# Altium schematic sheet GPT_NLP_DC Board.SchDoc
size C; SheetNumber: 1; SheetTotal: 4
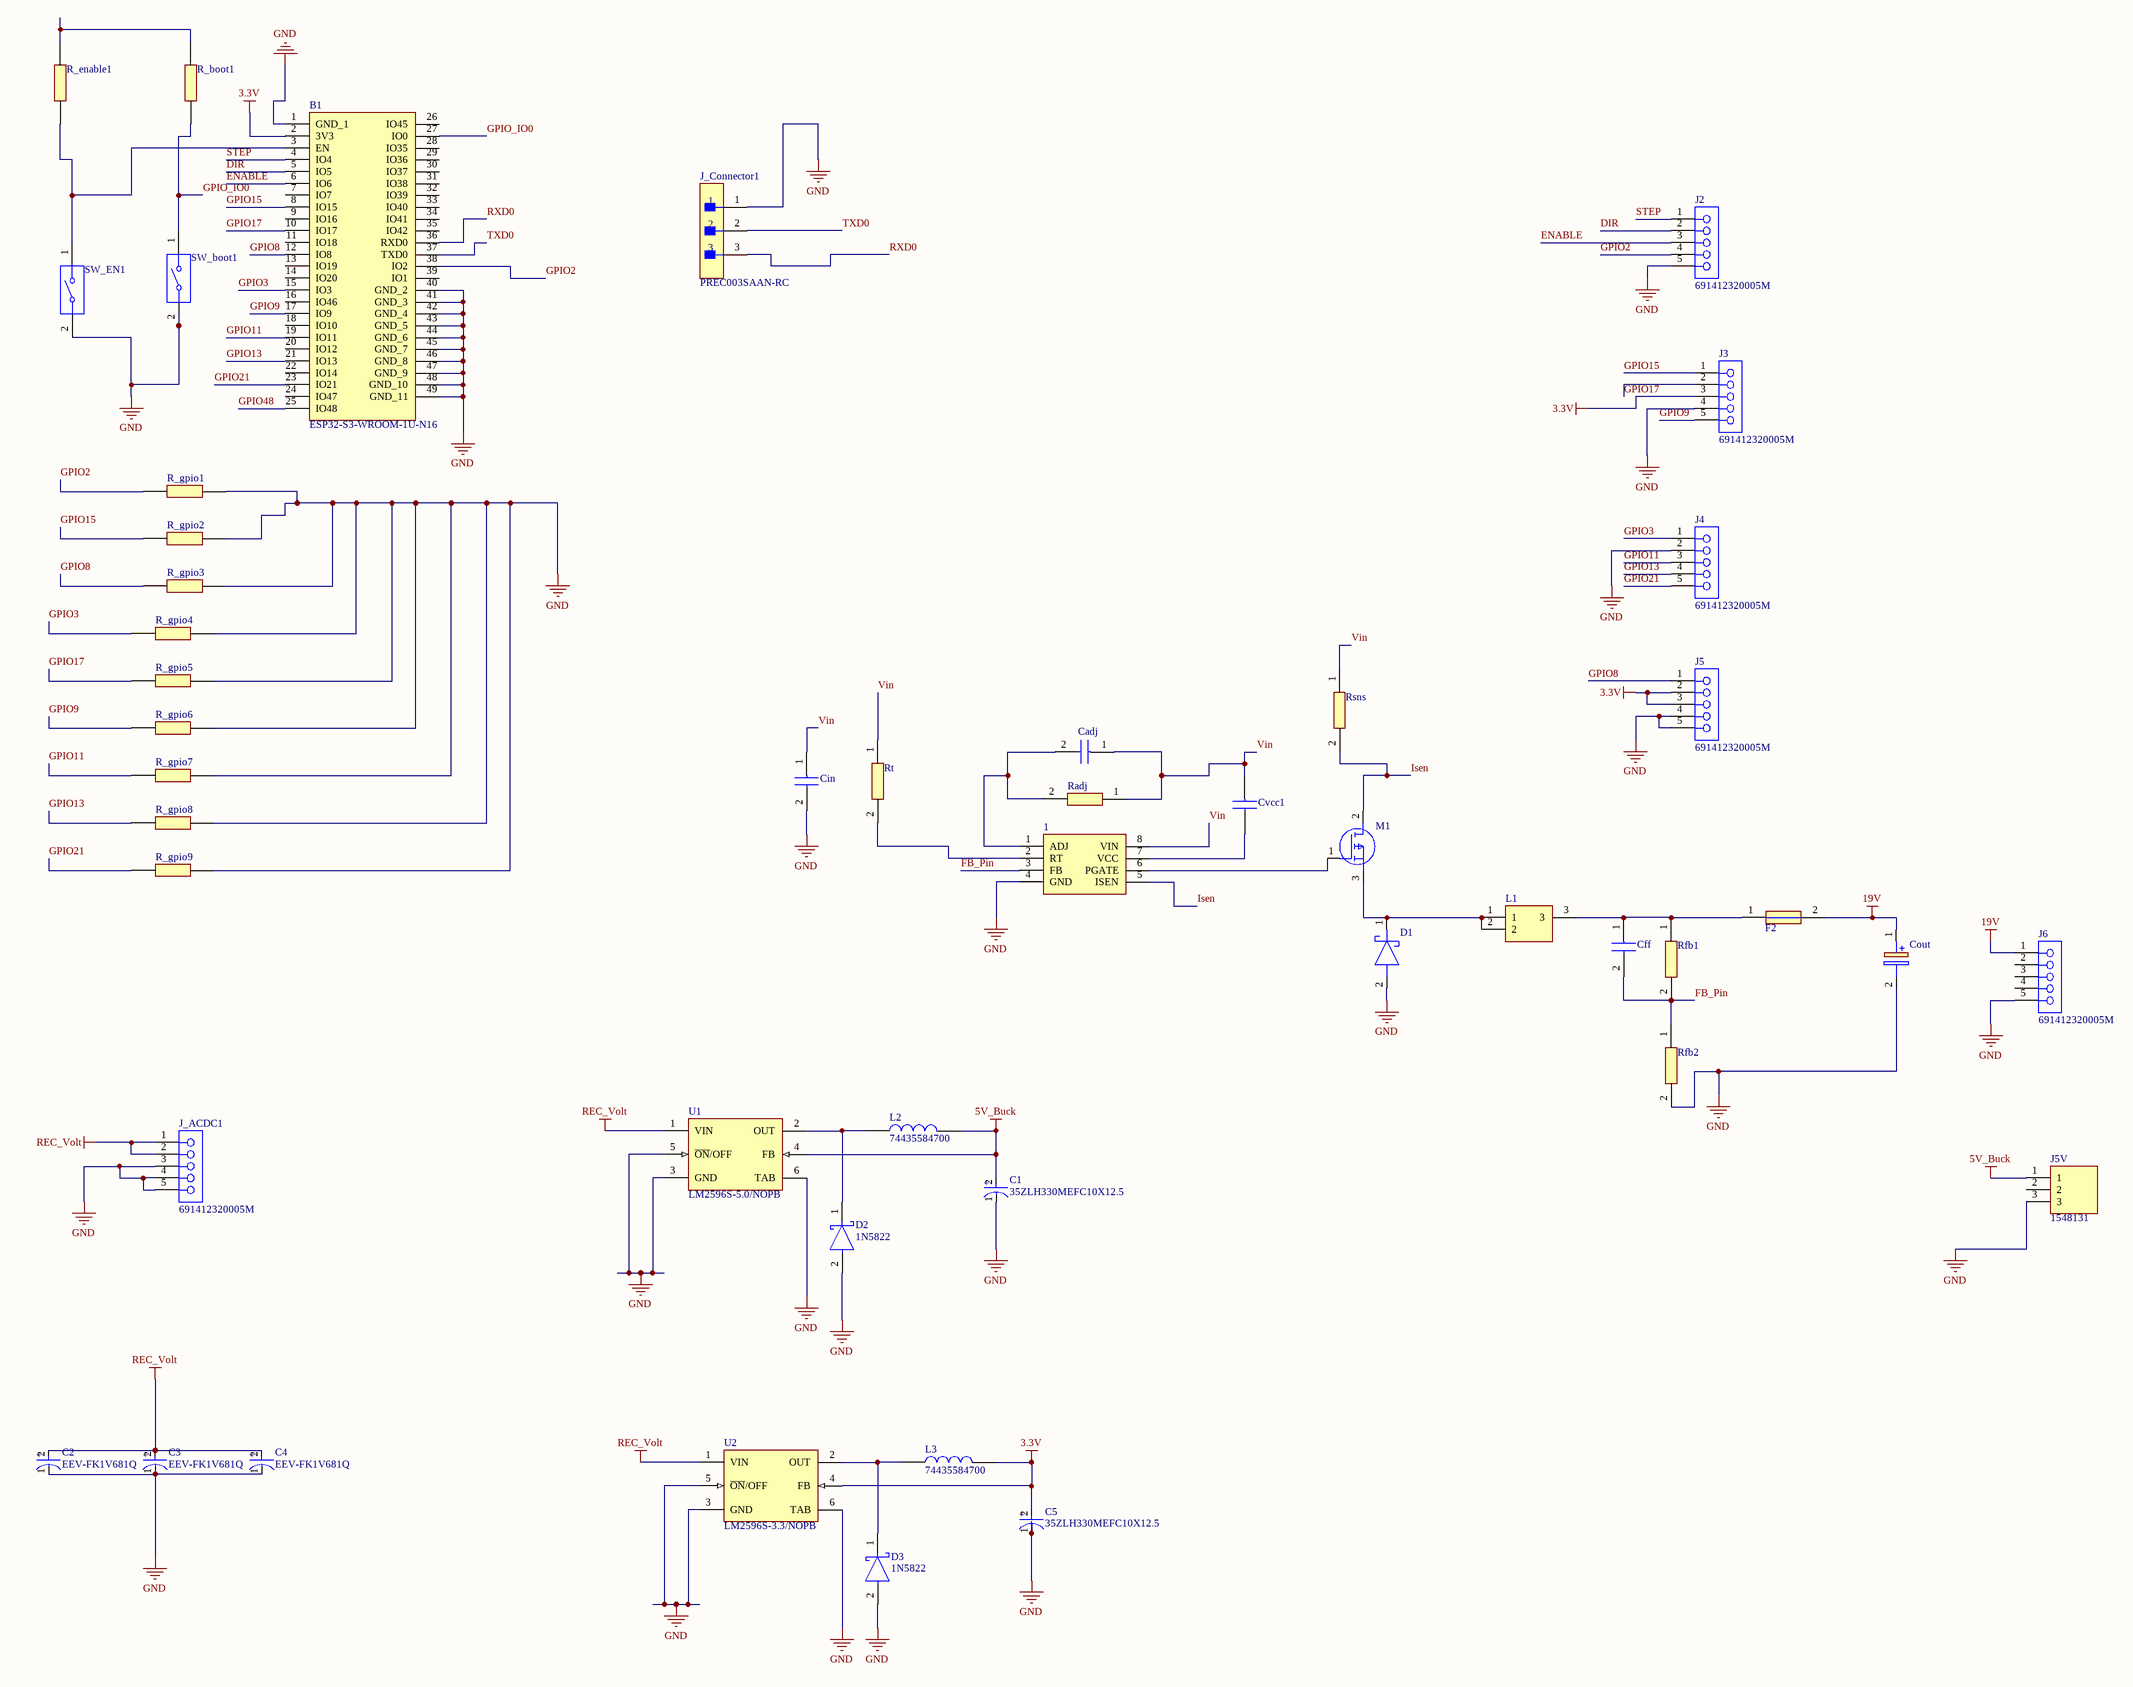
[diagram p0: GPT_NLP_DC Board.SchDoc]

## Parts
1  LM25085AMM_NOPB  [SOP65P490X110-8N]  (value not drawn)
B1  ESP32-S3-WROOM-1U-N16  [ESP32S3WROOM1UN16]
C1  35ZLH330MEFC10X12.5  [FP-35ZLH330MEFC10X12_5-MFG]
C2  EEV-FK1V681Q  [FP-FKH13-MFG]
C3  EEV-FK1V681Q  [FP-FKH13-MFG]
C4  EEV-FK1V681Q  [FP-FKH13-MFG]
C5  35ZLH330MEFC10X12.5  [FP-35ZLH330MEFC10X12_5-MFG]
Cadj  C1206C102K5GACTU  [C1206]  (value not drawn)
Cff  (no value)  [C1206]
Cin  MSASU32MSB5106KPNA01  [CAPC3225X270N]  (value not drawn)
Cout  293D106X9063E2TE3  [CAPPM7343X430N]  (value not drawn)
Cvcc1  TMK212BJ474KD-T  [CAPC2012X95N]  (value not drawn)
D1  SS24FL  [SODFL3617X108N]  (value not drawn)
D2  1N5822  [FP-DO-201AD-MFG]
D3  1N5822  [FP-DO-201AD-MFG]
F2  0407006.WR  [FUSC3216X98N]  (value not drawn)
J2  691412320005M  [691412320005M]
J3  691412320005M  [691412320005M]
J4  691412320005M  [691412320005M]
J5  691412320005M  [691412320005M]
J5V  1548131  [1548131]
J6  691412320005M  [691412320005M]
J_ACDC1  691412320005M  [691412320005M]
J_Connector1  PREC003SAAN-RC  [FP-PREC003SAAN-RC-MFG]
L1  SER2915L-153KL  [SER2918H333KL]  (value not drawn)
L2  74435584700  [INDM225220X1240N]
L3  74435584700  [INDM225220X1240N]
M1  SUD50P04-08-GE3  [SIHD3N50DT4GE3]  (value not drawn)
R_boot1  CRCW121010K0JNEAIF  [RESC3225X60N]  (value not drawn)
R_enable1  CRCW121010K0JNEAIF  [RESC3225X60N]  (value not drawn)
R_gpio1  CRCW121010K0JNEAIF  [RESC3225X60N]  (value not drawn)
R_gpio2  CRCW121010K0JNEAIF  [RESC3225X60N]  (value not drawn)
R_gpio3  CRCW121010K0JNEAIF  [RESC3225X60N]  (value not drawn)
R_gpio4  CRCW121010K0JNEAIF  [RESC3225X60N]  (value not drawn)
R_gpio5  CRCW121010K0JNEAIF  [RESC3225X60N]  (value not drawn)
R_gpio6  CRCW121010K0JNEAIF  [RESC3225X60N]  (value not drawn)
R_gpio7  CRCW121010K0JNEAIF  [RESC3225X60N]  (value not drawn)
R_gpio8  CRCW121010K0JNEAIF  [RESC3225X60N]  (value not drawn)
R_gpio9  CRCW121010K0JNEAIF  [RESC3225X60N]  (value not drawn)
Radj  CRCW12062K21FKEA  [RESC3216X60N]  (value not drawn)
Rfb1  RC1206FR-0710KL  [RESC3116X65N]  (value not drawn)
Rfb2  CRCW1206499RFKEA  [RESC3216X60N]  (value not drawn)
Rsns  CSR1206FK10L0  [RESC3016X65N]  (value not drawn)
Rt  CRCW1206665KFKEA  [RESC3216X60N]  (value not drawn)
SW_boot1  MX1A-11NW  [CHRY-MX1A-11NW_V]  (value not drawn)
SW_EN1  MX1A-11NW  [CHRY-MX1A-11NW_V]  (value not drawn)
U1  LM2596S-5.0/NOPB  [KTT0005B_M]
U2  LM2596S-3.3/NOPB  [KTT0005B_M]

## Nets
3.3V: B1.2(3V3) C5.2(A) J3.3 J5.2 J5.3 L3.2 U2.4(FB)
5V_Buck: C1.2(A) J5V.1 L2.2 U1.4(FB)
19V: Cout.1(+) F2.2 J6.1
GND: 1.4(GND) B1.1(GND_1) B1.40(GND_2) B1.41(GND_3) B1.42(GND_4) B1.43(GND_5) B1.44(GND_6) B1.45(GND_7) B1.46(GND_8) B1.47(GND_9) B1.48(GND_10) B1.49(GND_11) C1.1(C) C2.1(C) C3.1(C) C4.1(C) C5.1(C) Cin.2 Cout.2(-) D1.2(A) D2.2(A) D3.2(A) J2.5 J3.4 J4.2 J5.4 J5.5 J5V.3 J6.5 J_ACDC1.3 J_ACDC1.4 J_ACDC1.5 J_Connector1.1 R_gpio1.2 R_gpio2.2 R_gpio3.2 R_gpio4.2 R_gpio5.2 R_gpio6.2 R_gpio7.2 R_gpio8.2 R_gpio9.2 Rfb2.2 SW_boot1.2 SW_EN1.2 U1.3(GND) U1.5(~{ON}/OFF) U1.6(TAB) U2.3(GND) U2.5(~{ON}/OFF) U2.6(TAB)
REC_Volt: C2.2(A) C3.2(A) C4.2(A) J_ACDC1.1 J_ACDC1.2 U1.1(VIN) U2.1(VIN)
DIR: B1.5(IO5) J2.2
ENABLE: B1.6(IO6) J2.3
FB_Pin: 1.3(FB) Cff.2 Rfb1.2 Rfb2.1
GPIO2: B1.38(IO2) J2.4 R_gpio1.1
GPIO3: B1.15(IO3) J4.1 R_gpio4.1
GPIO8: B1.12(IO8) J5.1 R_gpio3.1
GPIO9: B1.17(IO9) J3.5 R_gpio6.1
GPIO11: B1.19(IO11) J4.3 R_gpio7.1
GPIO13: B1.21(IO13) J4.4 R_gpio8.1
GPIO15: B1.8(IO15) J3.1 R_gpio2.1
GPIO17: B1.10(IO17) J3.2 R_gpio5.1
GPIO21: B1.23(IO21) J4.5 R_gpio9.1
GPIO48: B1.25(IO48)
GPIO_IO0: B1.27(IO0) R_boot1.1 SW_boot1.1
Isen: 1.5(ISEN) M1.2(D) Rsns.2
RXD0: B1.36(RXD0) J_Connector1.3
STEP: B1.4(IO4) J2.1
TXD0: B1.37(TXD0) J_Connector1.2
Vin: 1.8(VIN) Cadj.1 Cin.1 Cvcc1.2 Radj.1 Rsns.1 Rt.1
Net1_1: 1.1(ADJ) Cadj.2 Radj.2
Net1_2: 1.2(RT) Rt.2
Net1_6: 1.6(PGATE) M1.1(G)
Net1_7: 1.7(VCC) Cvcc1.1
NetB1_3: B1.3(EN) R_enable1.1 SW_EN1.1
NetCff_1: Cff.1 F2.1 L1.3 Rfb1.1
NetD1_1: D1.1(K) L1.1 L1.2 M1.3(S)
NetD2_1: D2.1(C) L2.1 U1.2(OUT)
NetD3_1: D3.1(C) L3.1 U2.2(OUT)
NetR_boot1_2: R_boot1.2 R_enable1.2

Not connected (* = marked no-connect by the designer): B1 7(IO7) 9(IO16) 11(IO18) 13(IO19) 14(IO20) 16(IO46) 18(IO10) 20(IO12) 22(IO14) 24(IO47) 26(IO45) 28(IO35) 29(IO36) 30(IO37) 31(IO38) 32(IO39) 33(IO40) 34(IO41) 35(IO42) 39(IO1); J5V 2; J6 2 3 4

## Notes on the sheet
- (in symbol CMP-01474-19941892-1) +
- (in symbol CMP-05427-002172-1) +

## Library data of the parts
1 = LM25085AMM_NOPB: Integrated Circuit; Manufacturer_Name: Texas Instruments; Manufacturer_Part_Number: LM25085AMM/NOPB; Datasheet Link: http://www.ti.com/lit/gpn/LM25085A; Height: 1.1mm; Mouser Part Number: 926-LM25085AMM/NOPB; Mouser Price/Stock: https://www.mouser.co.uk/ProductDetail/Texas-Instruments/LM25085AMM-NOPB?qs=X1J7HmVL2ZFzLd0kBZ%2FkDw%3D%3D
B1 = ESP32-S3-WROOM-1U-N16: Multiprotocol Modules SMD Module, ESP32-S3, 16 MB SPI Flash, IPEX Antenna Connector; Manufacturer_Name: Espressif Systems; Geometry.Height: 3.35mm; Manufacturer_Part_Number: ESP32-S3-WROOM-1U-N16; Mouser Part Number: 356-ESP32S3WROM1UN16; Mouser Price/Stock: https://www.mouser.co.uk/ProductDetail/Espressif-Systems/ESP32-S3-WROOM-1U-N16?qs=Li%252BoUPsLEntAI1ynUyotnA%3D%3D; Arrow Part Number: *; Arrow Price/Stock: *; Datasheet Link: https://www.espressif.com/sites/default/files/documentation/esp32-s3-wroom-1_wroom-1u_datasheet_en.pdf
C1 C5 = CMP-01474-19941892-1: 35ZLH330MEFC10X12.5 Radial Can ALUMINUM ELECTROLYTIC CAPACITOR ZLH 35V 330muF ±20% 0.394Dia 10.00mm; Life (Hours): 10000hours; Ripple Current: 1.33A; Lead Diameter: 600µm; Dissipation Factor: 12%; Impedance: 39mΩ; Leakage Current: 3µA; Capacitance: 330µF; Dielectric Material: Aluminium; Voltage Rating (AC): 35V; Radiation Hardening: No; Voltage Rating: 35V; Min Operating Temperature: -40°C; Lead Pitch: 5mm; REACH SVHC: No SVHC; Max Operating Temperature: 105°C; Tolerance: 20%; Features: General Purpose; Diameter: 10mm; Schedule B: 8532220020; Height: 12.5mm; Ripple Current (AC): 1.33A; Number of Pins: 2; Lead Free: Lead Free; RoHS: Compliant; Mount: Through Hole; NexarPartId: 19941892; Voltage Rating (DC): 35V; ESR (Equivalent Series Resistance): 39mΩ; Termination: Radial; Voltage: 35V; Height - Seated (Max): 13.9954mm; Case/Package: Radial
C2-C4 = CMP-05427-002172-1: CAP ALUM 680UF 20% 35V SMD; Ripple Current (AC): 1.1A; Life (Hours): 5000Hour; Material: Aluminium; ESR (Equivalent Series Resistance): 60mR; Leakage Current: 3uA; Max Operating Temperature: 105°C; Min Operating Temperature: -55°C; Reach SVHC Compliant: Yes; Radiation Hardening: No; Length: 14mm; Package Quantity: 200; Width: 900um; Mount: Surface Mount; Ripple Current: 1.1A; Lead Free: Lead Free; Case/Package: Radial; Voltage Rating (DC): 35V; Termination: SMD/SMT; Capacitance: 680uF; Series: FK; Packaging: Tape and Reel; Voltage: 35V; Height: 13.5mm; Construction: Cylindrical; Voltage Rating: 35V; Ratings: AEC-Q200; Contact Plating: Tin; Impedance: 60mR; Height - Seated (Max): 0.531inch; Diameter: 12.5mm; RoHS Compliant: Yes; Tolerance: 20%
Cadj = C1206C102K5GACTU: Capacitor; Manufacturer_Name: YAGEO; Datasheet Link: https://content.kemet.com/datasheets/KEM_C1003_C0G_SMD.pdf; Manufacturer_Part_Number: C1206C102K5GACTU
Cff = C1206C333K5RACTU: Capacitor; Manufacturer_Name: YAGEO; Datasheet Link: https://content.kemet.com/datasheets/KEM_C1002_X7R_SMD.pdf; Manufacturer_Part_Number: C1206C333K5RACTU; Mouser Part Number: 80-C1206C333K5R; Mouser Price/Stock: https://www.mouser.com/Search/Refine.aspx?Keyword=80-C1206C333K5R
Cin = MSASU32MSB5106KPNA01: Capacitor; Manufacturer_Name: TAIYO YUDEN; Datasheet Link: https://4donline.ihs.com/images/VipMasterIC/IC/TAIY/TAIY-S-A0018972909/TAIY-S-A0018972909-1.pdf?hkey=61A2E4C270F0397D049F8F05BD4F1054; Height: 2.7mm; Manufacturer_Part_Number: MSASU32MSB5106KPNA01
Cout = 293D106X9063E2TE3: Capacitor Polarised; Manufacturer_Name: Vishay; Datasheet Link: http://www.vishay.com/docs/40002/293d.pdf; Height: 4.3mm; Manufacturer_Part_Number: 293D106X9063E2TE3; Mouser Part Number: 74-293D106X9063E2TE3; Mouser Price/Stock: https://www.mouser.co.uk/ProductDetail/Vishay-Sprague/293D106X9063E2TE3?qs=CPcc0c%2Fon9Gw9HhZerL1xQ%3D%3D; Arrow Part Number: 293D106X9063E2TE3; Arrow Price/Stock: https://www.arrow.com/en/products/293d106x9063e2te3/vishay
Cvcc1 = TMK212BJ474KD-T: TAIYO YUDEN - TMK212BJ474KD-T - CERAMIC CAPACITOR 0.47UF, 25V, X5R, 10%, 0805; Geometry.Height: 0.95mm; Mouser Part Number: 963-TMK212BJ474KD-T; Mouser Price/Stock: https://www.mouser.co.uk/ProductDetail/TAIYO-YUDEN/TMK212BJ474KD-T?qs=PzICbMaShUcnyRLJVHq5%252BA%3D%3D; Manufacturer_Name: TAIYO YUDEN; Manufacturer_Part_Number: TMK212BJ474KD-T; Datasheet Link: https://componentsearchengine.com/Datasheets/2/TMK212BJ474KD-T.pdf
D1 = SS24FL: Schottky Diode; Manufacturer_Name: onsemi; Datasheet Link: https://www.onsemi.com/pub/Collateral/SS26FL-D.PDF; Height: 1.08mm; Manufacturer_Part_Number: SS24FL; Mouser Part Number: 512-SS24FL; Mouser Price/Stock: https://www.mouser.co.uk/ProductDetail/onsemi-Fairchild/SS24FL?qs=tqW9UTzndZyvT5hdH%252BfSxg%3D%3D; Arrow Part Number: SS24FL; Arrow Price/Stock: https://www.arrow.com/en/products/ss24fl/on-semiconductor?utm_currency=USD&region=europe
D2 D3 = CMP-12187-000025-1: DIODE SCHOTTKY 40V 3A DO201AD; Manufacturer: STMicroelectronics; Max Junction Temp: +150°C; Peak Reverse Current: 2mA; Max Surge Forward Current: 80A; Temperature Range High: +150°C; Automotive: No; RoHS: TRUE; ComponentLink2Description: Datasheet; Manufacturer Part Number: 1N5822; Lead Free: Yes; Octopart: https://octopart.com/1n5822-stmicroelectronics-323225; Device Class L2: Diodes; Max Repetitive Reverse Voltage: 40V; Temperature: to +150°C; Height: 5.3mm; Category: Diode; Digikey Description: DIODE SCHOTTKY 40V 3A DO201AD; ComponentLink2URL: https://www.st.com/resource/en/datasheet/1n5822.pdf; Device Class L3: Schottky Diodes; Device Class L1: Discrete Semiconductors; Forward Current: 3A; Mouser Description: Schottky Diodes & Rectifiers Vr/40V Io/3A BULK; Package: DO-201AD
F2 = 0407006.WR: Fuse; Manufacturer_Name: LITTELFUSE; Datasheet Link: https://m.littelfuse.com/~/media/electronics/datasheets/littelfuse_fuse_407_datasheet.pdf.pdf; Height: 0.985mm; Manufacturer_Part_Number: 0407006.WR; Mouser Part Number: 576-0407006.WR; Mouser Price/Stock: https://www.mouser.co.uk/ProductDetail/Littelfuse/0407006.WR?qs=sPbYRqrBIVmH0oD7q%252BOKfw%3D%3D; Arrow Part Number: 0407006.WR; Arrow Price/Stock: https://www.arrow.com/en/products/0407006.wr/littelfuse?utm_currency=USD&region=nac
J2-J6 J_ACDC1 = CMP-03913-78871500-2: Terminal Block, 3.81MM Pitch, 45 Deg, Screwless, 16 -30 AWG, 5 Pins; Packaging: Box; Lead Pitch: 3.81mm; Number of Pins: 5
J5V = 1548131: Pluggable Terminal Blocks SMKDSN 1,5/ 3-5,08 SPE; Manufacturer_Name: Phoenix Contact; Geometry.Height: 11.15mm; Mouser Part Number: 651-1548131; Mouser Price/Stock: https://www.mouser.co.uk/ProductDetail/Phoenix-Contact/1548131?qs=ulEaXIWI0c9GjnZKo%252BcsiA%3D%3D; Manufacturer_Part_Number: 1548131; Datasheet Link: https://www.phoenixcontact.com/en-be/products/pcb-terminal-block-smkdsn-15-3-508-spe-1548131
J_Connector1 = CMP-00595-22265080-1: PREC003SAAN-RC Conn Header Vert 3POS 2.54MM; Number of Contacts: 3; Connector Type: Male Pin; Current Rating: 3A; Height: 8.74mm; Contact Mating Length: 5.842mm; Min Operating Temperature: -40°C; Termination: Solder; Packaging: Bulk; Pitch: 2.54mm; Color: Black; Mount: Through Hole; Contact Material: Nickel, Tin; Number of Rows: 1; NexarPartId: 22265080; Max Operating Temperature: 105°C; RoHS: Compliant; Contact Plating: Tin; Number of Positions: 3
L1 = SER2915L-153KL: Inductor; Manufacturer_Name: COILCRAFT; Datasheet Link: https://www.coilcraft.com/pdfs/ser2900.pdf; Height: 17mm; Manufacturer_Part_Number: SER2915L-153KL; Mouser Part Number: 994-SER2915L-153KL; Mouser Price/Stock: https://www.mouser.co.uk/ProductDetail/Coilcraft/SER2915L-153KL?qs=zCSbvcPd3pYvEeXdEWrnlg%3D%3D
L2 L3 = 74435584700: Wurth WE-HCI Series Shielded Wire-wound SMD Inductor with a MnZn Core, 47 uH +/-20% Flat Wire Winding 9A Idc; Manufacturer_Name: Wurth Elektronik; Geometry.Height: 12.4mm; Mouser Part Number: 710-74435584700; Mouser Price/Stock: https://www.mouser.co.uk/ProductDetail/Wurth-Elektronik/74435584700?qs=BXmE%252BJ0Y7xb1gG6%252BIK8ZPg%3D%3D; Manufacturer_Part_Number: 74435584700; Datasheet Link: https://componentsearchengine.com/Datasheets/2/74435584700.pdf
M1 = SUD50P04-08-GE3: MOSFET (P-Channel); Manufacturer_Name: Vishay; Datasheet Link: https://www.vishay.com/docs/65594/sud50p04-08.pdf; Height: 2.38mm; Manufacturer_Part_Number: SUD50P04-08-GE3; Mouser Part Number: 781-SUD50P04-08-GE3; Mouser Price/Stock: https://www.mouser.co.uk/ProductDetail/Vishay-Semiconductors/SUD50P04-08-GE3?qs=WX95TUc1y56BTDQkv3VCeQ%3D%3D; Arrow Part Number: SUD50P04-08-GE3; Arrow Price/Stock: https://www.arrow.com/en/products/sud50p04-08-ge3/vishay?region=europe
R_boot1 R_enable1 R_gpio1-R_gpio9 = CRCW121010K0JNEAIF: 10 kOhms +/-5% 0.5W, 1/2W Chip Resistor 1210 (3225 Metric) Automotive AEC-Q200, Pulse Withstanding Thick Film; Manufacturer_Name: Vishay; Geometry.Height: 0.6mm; Mouser Part Number: 71-CRCW121010K0JNAIF; Mouser Price/Stock: https://www.mouser.co.uk/ProductDetail/Vishay-Dale/CRCW121010K0JNEAIF?qs=i8QVZAFTkqQfG5tTLsUS4Q%3D%3D; Manufacturer_Part_Number: CRCW121010K0JNEAIF; Datasheet Link: https://www.vishay.com/docs/20024/dcrcwife3.pdf
Radj = CRCW12062K21FKEA: Resistor; Manufacturer_Name: Vishay; Datasheet Link: http://www.vishay.com/docs/20035/dcrcwe3.pdf; Height: 0.6mm; Manufacturer_Part_Number: CRCW12062K21FKEA; Mouser Part Number: 71-CRCW1206-2.21K-E3; Mouser Price/Stock: https://www.mouser.co.uk/ProductDetail/Vishay-Dale/CRCW12062K21FKEA?qs=v%252BxIQaJyuQoaBZMU5qB9Lw%3D%3D; Arrow Part Number: CRCW12062K21FKEA; Arrow Price/Stock: https://www.arrow.com/en/products/crcw12062k21fkea/vishay
Rfb1 = RC1206FR-0710KL: Resistor; Manufacturer_Name: YAGEO; Datasheet Link: https://www.yageo.com/upload/media/product/app/datasheet/rchip/pyu-rc_group_51_rohs_l.pdf; Height: 0.65mm; Manufacturer_Part_Number: RC1206FR-0710KL; Mouser Part Number: 603-RC1206FR-0710KL; Mouser Price/Stock: https://www.mouser.co.uk/ProductDetail/YAGEO/RC1206FR-0710KL?qs=%252BhB4WxZmbVEJV82xdVgRUw%3D%3D; Arrow Part Number: RC1206FR-0710KL; Arrow Price/Stock: https://www.arrow.com/en/products/rc1206fr-0710kl/yageo?utm_currency=USD&region=europe
Rfb2 = CRCW1206499RFKEA: Resistor; Manufacturer_Name: Vishay; Datasheet Link: http://www.vishay.com/docs/20035/dcrcwe3.pdf; Height: 0.6mm; Manufacturer_Part_Number: CRCW1206499RFKEA; Mouser Part Number: 71-CRCW1206-499-E3; Mouser Price/Stock: https://www.mouser.com/Search/Refine.aspx?Keyword=71-CRCW1206-499-E3
Rsns = CSR1206FK10L0: Resistor; Manufacturer_Name: Stackpole Electronics; Datasheet Link: https://cs.seielect.com/catalog/SEI-CSR_CSRN.pdf; Height: 0.65mm; Manufacturer_Part_Number: CSR1206FK10L0; Arrow Part Number: CSR1206FK10L0; Arrow Price/Stock: https://www.arrow.com/en/products/csr1206fk10l0/stackpole-electronics?region=nac
Rt = CRCW1206665KFKEA: Resistor; Manufacturer_Name: Vishay; Height: 0.6mm; Manufacturer_Part_Number: CRCW1206665KFKEA
SW_boot1 SW_EN1 = CMP-2000-06786-1: Keylock Switch, 12 V, -10 to 70 degC, 2-Pin THD, RoHS, Bulk; Manufacturer: Cherry; Part No: MX1A11NW; Maximum DC Voltage Rating: 12V; COO: UK; Row Spacing: 6.35mm; Pole Throw Configuration: SPST; Total Travel: 4.06mm; Illumination Type: N/R; Actuator Style: Button; Operating Force: 0.58N; Electrical Life: 50000000Cycle; Minimum Insulation Resistance: 100MOhm; Body Orientation: Straight; Actuator Length: 3.6mm; Switch Configuration: N.O.; Maximum Current Rating: 0.01A; Maximum Contact Resistance: 200mOhm; Actuator Color: N/A; Terminal Type: PCPins; Operating Temperature: -10to70C; Number of Terminals: 2; Operating Speed: N/A; Maximum AC Voltage Rating: 12V; Housing Material: N/A; Datasheet URL: https://cdn.sparkfun.com/datasheets/Components/Switches/MX%20Series.pdf; Type: DesktopProfile; Terminal Pitch: 2.54mm; Package Reference: MX1A-11NW; ECCN: EAR99; Family: MX; Packaging: N/A; HTS: 8536509065; Actuator Material: N/A; Package Description: 2-Pin Through Hole Device, Body 15.6 x 15.6 mm; Dielectric Strength: N/A; Illumination Color: N/R; Manufacturer URL: http://cherryswitches.com/cn/; Dimension: 15.6x15.6x15.2mm; Mechanical Life: N/A; RoHS: Unknown; Contact Plating: N/A; Supplier: CherryElectrical; Contact Material: Silver/Gold; IP Rating: N/A; Mounting: ThroughHole; Datasheet Version: 09/2000; Maximum Power Rating: N/A; Mounting Technology: ThroughHole
U1 = CMP-0069-00269-3: SIMPLE SWITCHER® Power Converter 150 KHz 3A Step-Down Voltage Regulator, 5-pin TO-263, Pb-Free; Manufacturer: Texas Instruments; PowerWise: N; PackageTopMarking: NSUZXYTTE#*LM2596S*-5.0 P+; ComponentLink1URL: http://www.ti.com/general/docs/lit/getliterature.tsp?genericPartNumber=LM2596&fileType=pdf; PackageDescription: TO-263, Molded, .400 x .390 x .180in, 5 Lead, .067in Pitch, Surface Mount; RoHS: Y; PinCount: 5; Code_JEDEC: MO-169-AB; ComponentLink1Description: Datasheet URL; PackageReference: KTT0005B; CompType: Switcher
U2 = CMP-0069-00275-3: SIMPLE SWITCHER® Power Converter 150 KHz 3A Step-Down Voltage Regulator, 5-pin TO-263, Pb-Free; Manufacturer: Texas Instruments; PackageTopMarking: NSUZXYTTE#*LM2596S*-3.3 P+; PowerWise: N; RoHS: Y; PackageReference: KTT0005B; PackageDescription: TO-263, Molded, .400 x .390 x .180in, 5 Lead, .067in Pitch, Surface Mount; PinCount: 5; ComponentLink1Description: Datasheet URL; Code_JEDEC: MO-169-AB; ComponentLink1URL: http://www.ti.com/general/docs/lit/getliterature.tsp?genericPartNumber=LM2596&fileType=pdf; CompType: Switcher